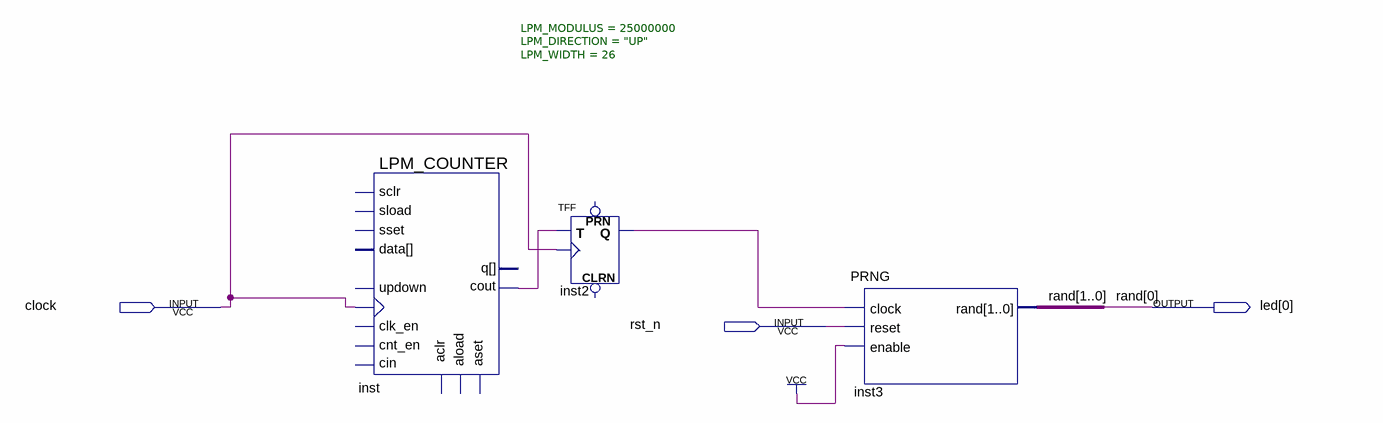
[diagram p0: schematic sheet]
// Quartus schematic teste_rng.bdf as structural Verilog: 3 symbols, 3 pins
module teste_rng (
  input  clock,
  input  rst_n,
  output [0:0] led
);

  wire inst2_q, inst_cout;
  wire [1:1] \rand ;

  LPM_COUNTER #(.LPM_MODULUS(25000000), .LPM_DIRECTION("UP"), .LPM_WIDTH(26)) inst (
    .clock(clock), .cout(inst_cout));  // open: sload, data, clk_en, aload, aclr, aset, cin, sset, updown, cnt_en, sclr, q
  TFF inst2 (.T(inst_cout), .CLK(clock), .Q(inst2_q));  // open: PRN, CLRN
  PRNG inst3 (.clock(inst2_q), .reset(rst_n), .enable(1'b1), .\rand ({\rand [1], led[0]}));

  // Other names for the same wires on the sheet: rand[0] = led[0]
endmodule
